# EAGLE design ecg (EAGLE 6.5.0)
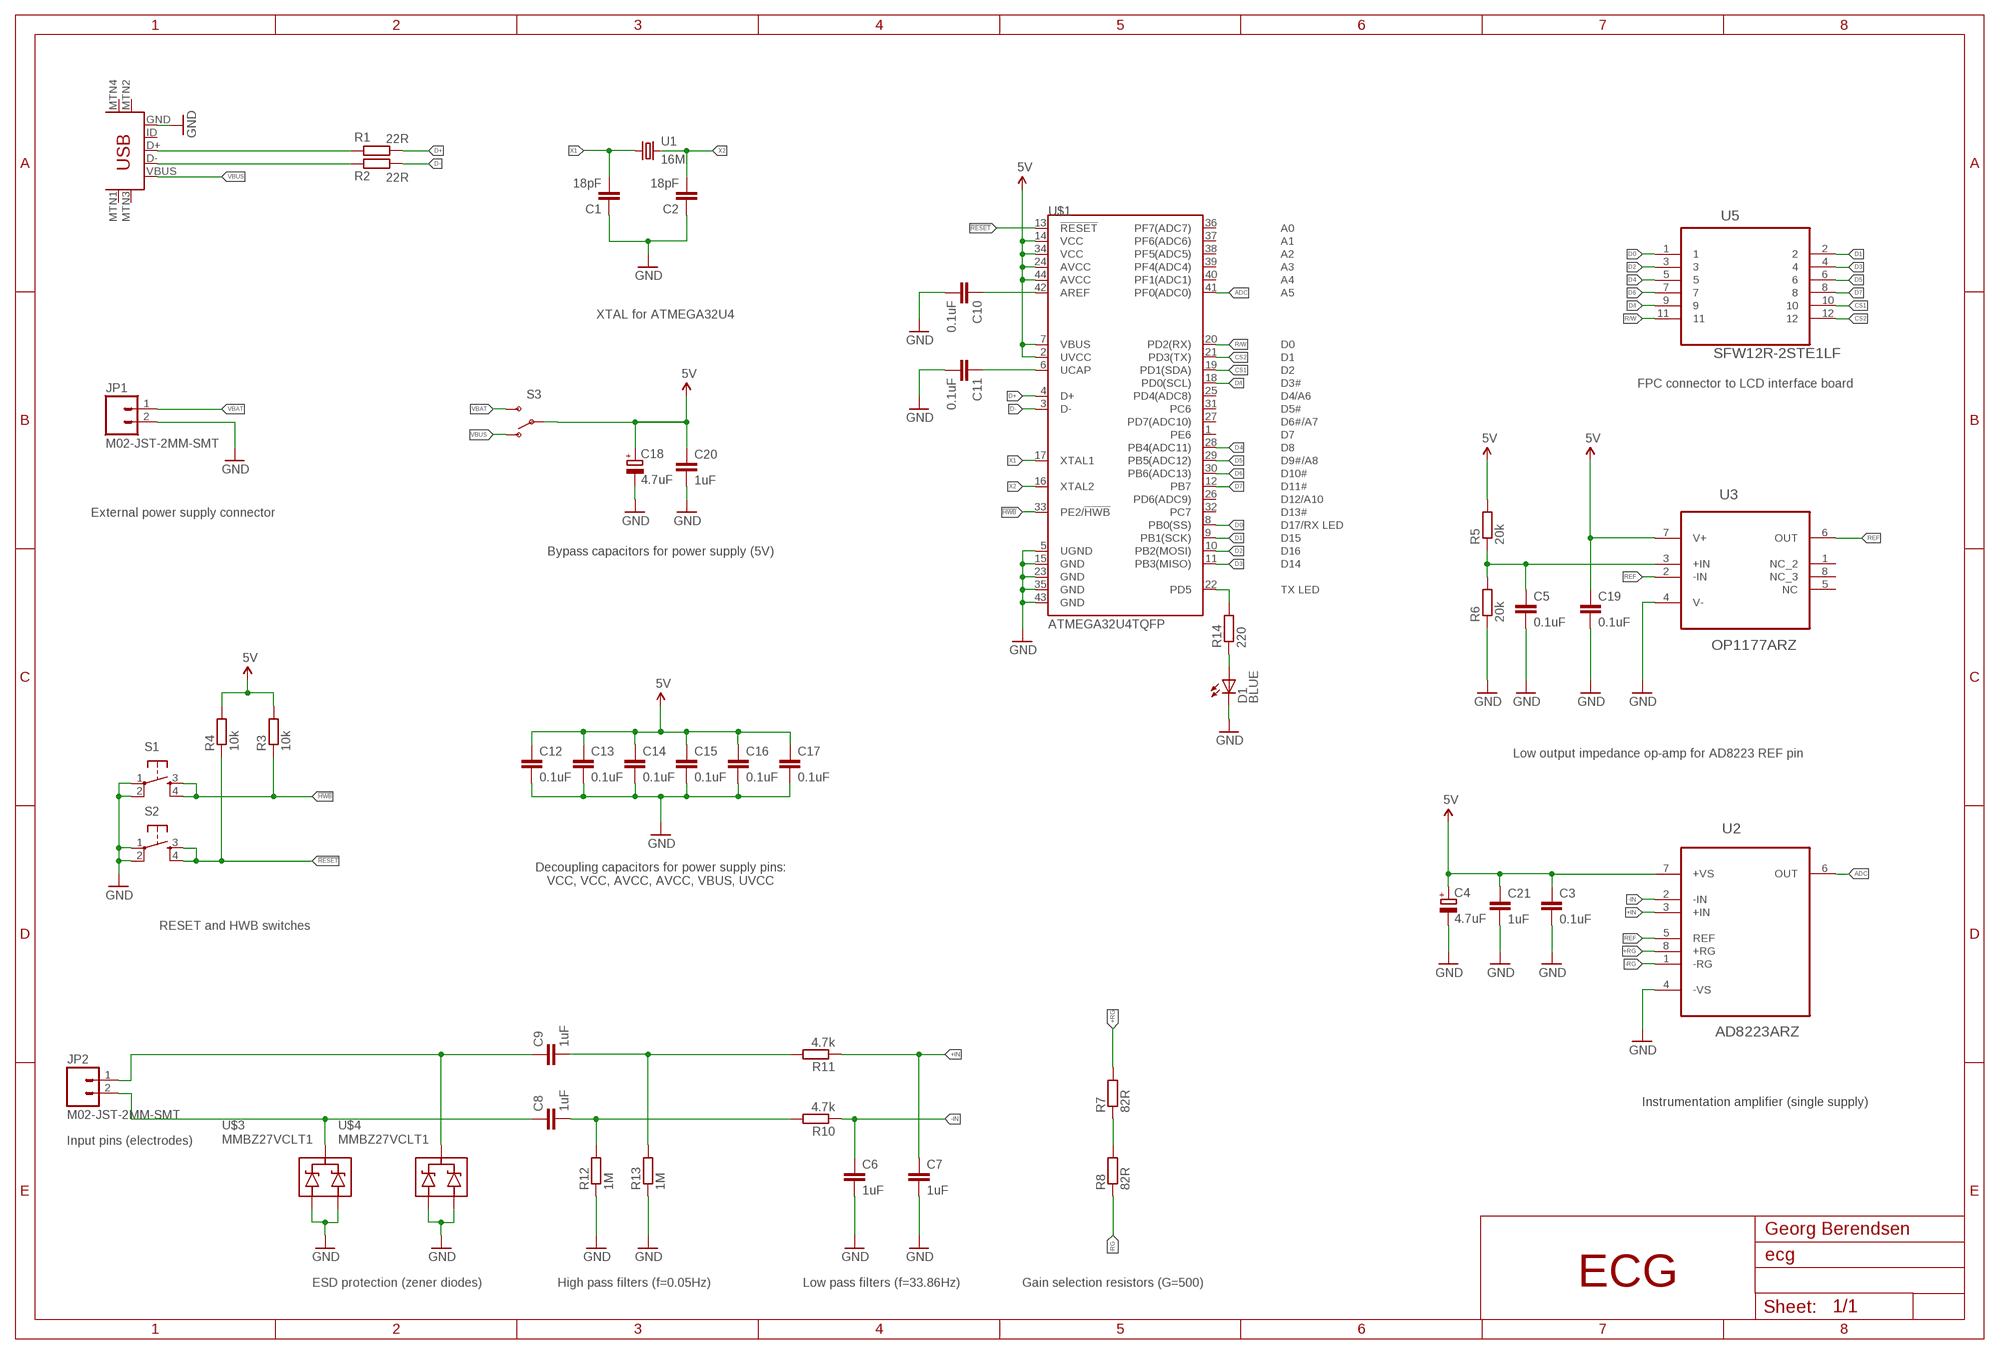
[diagram p0: schematic, sheet 1]

## Parts
C1  18pF  C-EUC0603  [C0603]
C2  18pF  C-EUC0603  [C0603]
C3  0.1uF  C-EUC0603  [C0603]
C4  4.7uF  CPOL-EUA  [PANASONIC_A]
C5  0.1uF  C-EUC0603  [C0603]
C6  1uF  C-EUC0603  [C0603]
C7  1uF  C-EUC0603  [C0603]
C8  1uF  C-EUC0603  [C0603]
C9  1uF  C-EUC0603  [C0603]
C10  0.1uF  C-EUC0603  [C0603]
C11  0.1uF  C-EUC0603  [C0603]
C12  0.1uF  C-EUC0603  [C0603]
C13  0.1uF  C-EUC0603  [C0603]
C14  0.1uF  C-EUC0603  [C0603]
C15  0.1uF  C-EUC0603  [C0603]
C16  0.1uF  C-EUC0603  [C0603]
C17  0.1uF  C-EUC0603  [C0603]
C18  4.7uF  CPOL-EUA  [PANASONIC_A]
C19  0.1uF  C-EUC0603  [C0603]
C20  1uF  C-EUC0603  [C0603]
C21  1uF  C-EUC0603  [C0603]
D1  BLUE  LED-BLUE0603  [LED-0603]
JP1  M02-JST-2MM-SMT  [JST-2-SMD]
JP2  M02-JST-2MM-SMT  [JST-2-SMD]
R1  22R  R-EU_R0603  [R0603]
R2  22R  R-EU_R0603  [R0603]
R3  10k  R-EU_R0603  [R0603]
R4  10k  R-EU_R0603  [R0603]
R5  20k  R-EU_R0603  [R0603]
R6  20k  R-EU_R0603  [R0603]
R7  82R  R-EU_R0603  [R0603]
R8  82R  R-EU_R0603  [R0603]
R10  4.7k  R-EU_R0603  [R0603]
R11  4.7k  R-EU_R0603  [R0603]
R12  1M  R-EU_R0603  [R0603]
R13  1M  R-EU_R0603  [R0603]
R14  220  R-EU_R0603  [R0603]
S1  TAC_SWITCHSMD  [TACTILE_SWITCH_SMD]
S2  TAC_SWITCHSMD  [TACTILE_SWITCH_SMD]
S3  SWITCH-SPDTSMD2  [SWITCH-SPDT-SMD]
U1  16M  CRYSTAL5X3  [CRYSTAL-SMD-5X3]
U2  AD8223ARZ  [SOIC127P600X175-8N]
U3  OP1177ARZ  [SOIC127P600X175-8N]
U5  SFW12R-2STE1LF  [FCI_SFW12R-2STE1LF]
U$1  ATMEGA32U4TQFP  [SPARKFUN-DIGITALIC_TQFP44]
U$2  USB-MINIB-5PIN  [USB-MINIB]
U$3  MMBZ27VCLT1  [SOT23-3]
U$4  MMBZ27VCLT1  [SOT23-3]

## Nets
5V: C3.1 C4.+ C12.1 C13.1 C14.1 C15.1 C16.1 C17.1 C18.+ C19.1 C20.1 C21.1 R3.2 R4.2 R5.2 S3.2(P) U2.7(+VS) U3.7(V+) U$1.2(UVCC) U$1.7(VBUS) U$1.14(VCC) U$1.24(AVCC) U$1.34(VCC) U$1.44(AVCC)
!HWB: R3.1 S1.3 S1.4 U$1.33(PE2/!HWB)
!RESET: R4.1 S2.3 S2.4 U$1.13(!RESET)
+IN: C7.1 R11.1 U2.3(+IN)
+RG: R7.2 U2.8(+RG)
-IN: C6.1 R10.1 U2.2(-IN)
-RG: R8.1 U2.1(-RG)
ADC: U2.6(OUT) U$1.41(PF0(ADC0))
CS1: U5.10 U$1.19(PD1(SDA))
CS2: U5.12 U$1.21(PD3(TX))
D0: U5.1 U$1.8(PB0(SS))
D1: U5.2 U$1.9(PB1(SCK))
D2: U5.3 U$1.10(PB2(MOSI))
D3: U5.4 U$1.11(PB3(MISO))
D4: U5.5 U$1.28(PB4(ADC11))
D5: U5.6 U$1.29(PB5(ADC12))
D6: U5.7 U$1.30(PB6(ADC13))
D7: U5.8 U$1.12(PB7)
D+: R1.1 U$1.4(D+)
D-: R2.1 U$1.3(D-)
D/I: U5.9 U$1.18(PD0(SCL))
GND: C1.1 C2.1 C3.2 C4.- C5.2 C6.2 C7.2 C10.2 C11.2 C12.2 C13.2 C14.2 C15.2 C16.2 C17.2 C18.- C19.2 C20.2 C21.2 D1.C JP1.2 R6.1 R12.1 R13.1 S1.1 S1.2 S2.1 S2.2 U2.4(-VS) U3.4(V-) U$1.5(UGND) U$1.15(GND) U$1.23(GND) U$1.35(GND) U$1.43(GND) U$2.GND U$3.1(A1) U$3.2(A2) U$4.1(A1) U$4.2(A2)
N$1: R1.2 U$2.D+
N$2: R2.2 U$2.D-
N$7: C9.1 JP2.1 U$4.3(C)
N$8: C8.1 JP2.2 U$3.3(C)
N$9: C10.1 U$1.42(AREF)
N$10: C11.1 U$1.6(UCAP)
N$11: D1.A R14.1
N$22: C8.2 R10.2 R12.2
N$23: C9.2 R11.2 R13.2
R/W: U5.11 U$1.20(PD2(RX))
REF: U2.5(REF) U3.2(-IN) U3.6(OUT)
REF_DIV: C5.1 R5.1 R6.2 U3.3(+IN)
RG/2: R7.1 R8.2
TX: R14.2 U$1.22(PD5)
VBAT: JP1.1 S3.3(S)
VBUS: S3.1(O) U$2.VBUS
X1: C1.2 U1.1 U$1.17(XTAL1)
X2: C2.2 U1.3 U$1.16(XTAL2)
Unconnected: U3.1(NC_2) U3.5(NC) U3.8(NC_3) U$1.1(PE6) U$1.25(PD4(ADC8)) U$1.26(PD6(ADC9)) U$1.27(PD7(ADC10)) U$1.31(PC6) U$1.32(PC7) U$1.36(PF7(ADC7)) U$1.37(PF6(ADC6)) U$1.38(PF5(ADC5)) U$1.39(PF4(ADC4)) U$1.40(PF1(ADC1)) U$2.ID U$2.MTN1(MTN2) U$2.MTN2(MTN3) U$2.MTN3(MTN1) U$2.MTN4

## Notes on the sheet
- XTAL for ATMEGA32U4
- FPC connector to LCD interface board
- External power supply connector
- Bypass capacitors for power supply (5V)
- Low output impedance op-amp for AD8223 REF pin
- Decoupling capacitors for power supply pins:
  VCC, VCC, AVCC, AVCC, VBUS, UVCC
- RESET and HWB switches
- Instrumentation amplifier (single supply)
- Input pins (electrodes)
- Georg Berendsen
- ESD protection (zener diodes) | High pass filters (f=0.05Hz) | Low pass filters (f=33.86Hz) | Gain selection resistors (G=500) | ECG

## Library data of the parts
C1-C3 C5-C17 C19-C21 = rcl:C-EU: CAPACITOR, European symbol
C4 C18 = rcl:CPOL-EU: POLARIZED CAPACITOR, European symbol
D1 = SparkFun-LED:LED-BLUE: Blue LEDs for production use Various blue LEDs stocked by SparkFun production 0603 - DIO-08575 Rebel - DIO-09553 1206 - DIO-09911; PROD_ID: DIO-08575
JP1 JP2 = SparkFun-Connectors:M02: Standard 2-pin 0.1" header. Use with - straight break away headers ( PRT-00116) - right angle break away headers (PRT-00553) - swiss pins (PRT-00743) - machine pins (PRT-00117) - female headers (PRT-00115) Molex polarized connector foot print use with: PRT-08233 with associated crimp pins and housings. 2.54_SCREWTERM for use with PRT-10571. 3.5mm Screw Terminal footprints for PRT-08084 5mm Screw Terminal footprints for use with PRT-08433; PROD_ID: CONN-08352
R1-R8 R10-R14 = rcl:R-EU_: RESISTOR, European symbol
S1 S2 = SparkFun-Electromechanical:TAC_SWITCH: Momentary Switch Button commonly used for reset or general input. Spark Fun Electronics SKU : COM-00097 SMT- SWCH-08247; PROD_ID: SWCH-08247
S3 = SparkFun-Electromechanical:SWITCH-SPDT: SPDT Switch Simple slide switch, Spark Fun Electronics SKU : COM-00102 DPDT SMT slide switch, AYZ0202, SWCH-08179
U1 = SparkFun-FreqCtrl:CRYSTAL: Various standard crystals. Proven footprints. Spark Fun Electronics SKU : COM-00534
U2 = AD8223:AD8223ARZ: Single-Supply, Low Cost Instrumentation Amplifier; MPN: AD8223ARZ; OC_FARNELL: 1838863; OC_NEWARK: 34P3215; PACKAGE: SOIC-8; SUPPLIER: Analog Devices
U3 = OP1177ARZ:OP1177ARZ: Precision Low Noise, Low Input Bias Current Operational Amplifiers
U5 = FCI-SFW12R-2STE1LF:SFW12R-2STE1LF: FFC/FPC CONNECTOR, RECEPTACLE 12POS 1ROW; MPN: SFW12R-2STE1LF; OC_FARNELL: 1632142; OC_NEWARK: 43K4079; PACKAGE: CONNECTOR-12POS; SUPPLIER: FCI
U$1 = SparkFun-DigitalIC:ATMEGA32U4: Atmel 44-pin 8-bit Microcontroller with 32KBytes of ISP Flash and USB Controller ----- Please use the QFN-44-NOPAD_1:1 package for the footprint of all boards using a 32U4. Route traces directly away from the pads as much as possible.
U$2 = SparkFun-Connectors:USB-MINIB: Mini-USB "B" connector with 5th pin broken out. Created new symbol breaking out 5th "ID" pin in mini/micro USB connector spec. See: http://en.wikipedia.org/wiki/Mini_usb#Cables. Uses same footprint as 4-pin symbol. Also added pins to connect to mounting / shield pads if required (probably not generally needed as signals aren't shielded once they leave the connector).
U$3 U$4 = SparkFun-DiscreteSemi:MMBZ27VCLT1: 40W Zener-diode transient voltage suppressor (ESD protection)

## Board
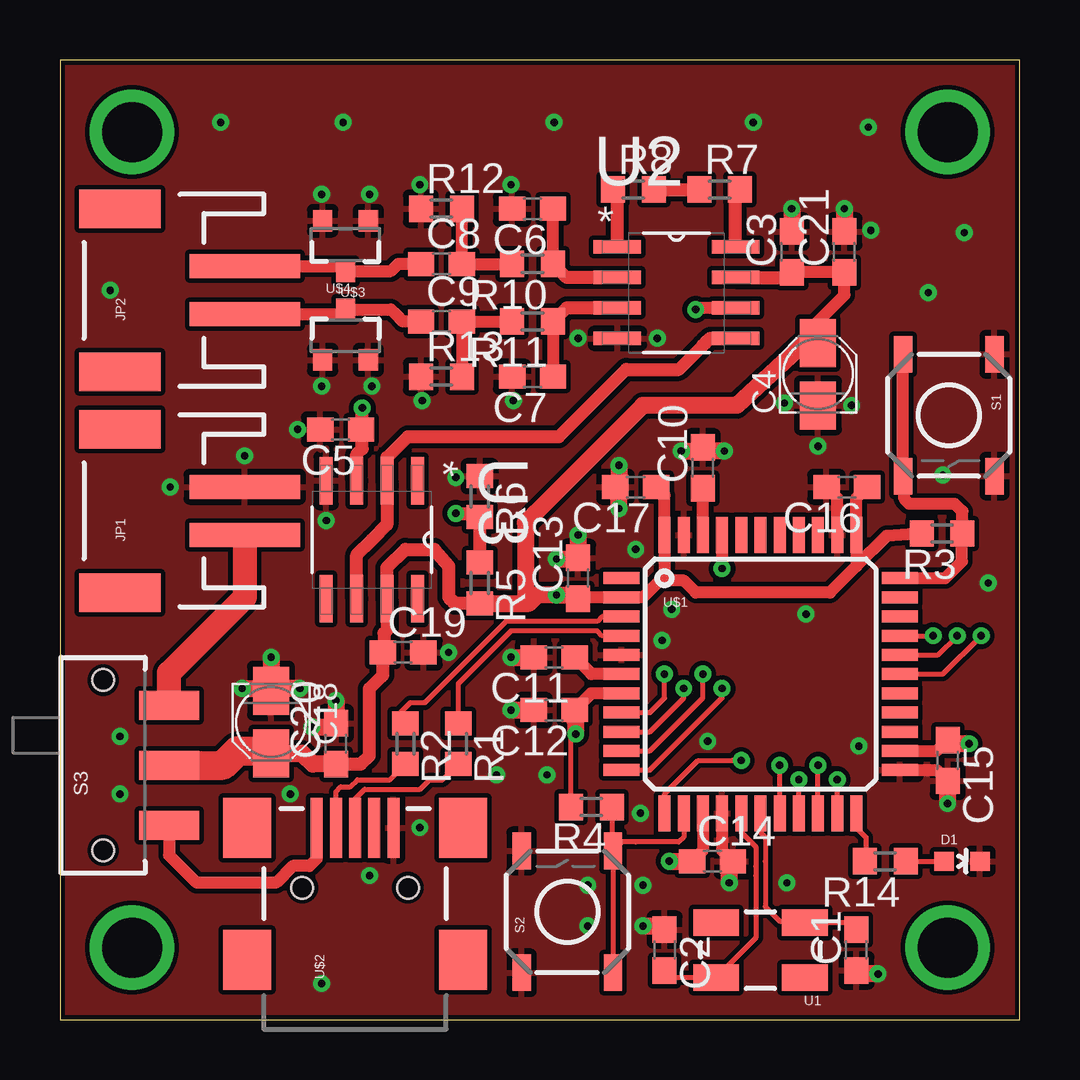
[diagram p1: board, top side]
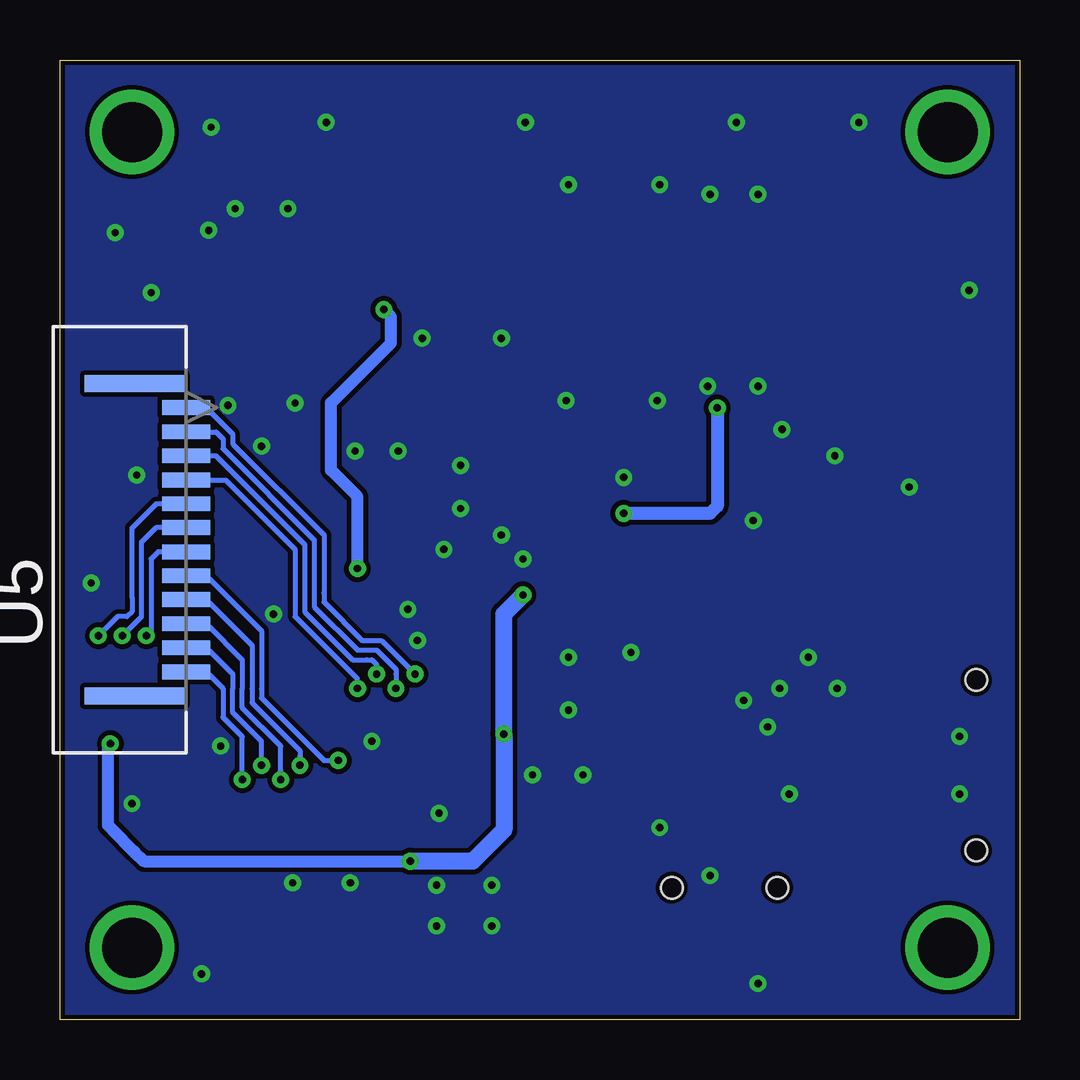
[diagram p2: board, bottom side, seen from below]

Size 40 x 40 mm. Coordinates in mm from the lower left corner, seen from the top.
Outline: 0,0 40,0 40,40 0,40 0,0
Copper layers (1*16): Top 0.035mm / dielectric 1.5mm / Bottom 0.035mm
Design rules "default *": minimum track width 0.2mm, minimum drill 0.3mm, track to track 0.2mm, track to pad 0.2mm, pad to pad 0.2mm, via to via 0.2mm, smd to smd 0mil, copper to edge 0.2mm, drill to drill 8mil, minimum pad ring 10mil, minimum via ring 8mil, stop-mask expansion 4mil, vias tented up to drill 0mil, thermal gap 10mil

### Footprints (pad centres in the part's own frame; a part is rotated, then mirrored left to right if it is on the bottom)
C0603 = smd 1.1 x 1: 1 -0.85,0; 2 0.85,0
PANASONIC_A = smd 2 x 1.5: + 1.3,0; - -1.3,0
LED-0603 = smd 0.8 x 0.8: A 0,-0.75; C 0,0.75
JST-2-SMD = smd 1 x 4.6: 1 -1,-3.7; 2 1,-3.7 | smd 1.6 x 3.4: NC1 -3.4,1.5; NC2 3.4,1.5
R0603 = smd 1 x 1.1: 1 -0.85,0; 2 0.85,0
TACTILE_SWITCH_SMD = smd 1.524 x 0.762: 1 -2.54,1.905; 2 2.54,1.905; 3 -2.54,-1.905; 4 2.54,-1.905
SWITCH-SPDT-SMD = smd 1.2 x 2.5: 1 -2.5,-2.75; 2 0,-2.75; 3 2.5,-2.75 | hole 0.9: -3.55,0; 3.55,0
CRYSTAL-SMD-5X3 = smd 1.9 x 1.1: 1 -1.85,-1.15; 2 1.85,-1.15; 3 1.85,1.15; 4 -1.85,1.15
SOIC127P600X175-8N = smd 1.981 x 0.559: 1 -2.464,1.905; 2 -2.464,0.635; 3 -2.464,-0.635; 4 -2.464,-1.905; 5 2.464,-1.905; 6 2.464,-0.635; 7 2.464,0.635; 8 2.464,1.905
FCI_SFW12R-2STE1LF = smd 0.61 x 2.007: 1 5.512,2.743; 2 4.496,2.743; 3 3.505,2.743; 4 2.489,2.743; 5 1.499,2.743; 6 0.508,2.743; 7 -0.508,2.743; 8 -1.499,2.743; 9 -2.489,2.743; 10 -3.505,2.743; 11 -4.496,2.743; 12 -5.512,2.743 | smd 0.711 x 4.191: 13 -6.502,4.877; 14 6.502,4.877
SPARKFUN-DIGITALIC_TQFP44 = smd 1.5 x 0.5: 1 -5.8,4; 2 -5.8,3.2; 3 -5.8,2.4; 4 -5.8,1.6; 5 -5.8,0.8; 6 -5.8,0; 7 -5.8,-0.8; 8 -5.8,-1.6; 9 -5.8,-2.4; 10 -5.8,-3.2; 11 -5.8,-4; 23 5.8,-4; 24 5.8,-3.2; 25 5.8,-2.4; 26 5.8,-1.6; 27 5.8,-0.8; 28 5.8,0; 29 5.8,0.8; 30 5.8,1.6; 31 5.8,2.4; 32 5.8,3.2; 33 5.8,4 | smd 0.5 x 1.5: 12 -4,-5.8; 13 -3.2,-5.8; 14 -2.4,-5.8; 15 -1.6,-5.8; 16 -0.8,-5.8; 17 0,-5.8; 18 0.8,-5.8; 19 1.6,-5.8; 20 2.4,-5.8; 21 3.2,-5.8; 22 4,-5.8; 34 4,5.8; 35 3.2,5.8; 36 2.4,5.8; 37 1.6,5.8; 38 0.8,5.8; 39 0,5.8; 40 -0.8,5.8; 41 -1.6,5.8; 42 -2.4,5.8; 43 -3.2,5.8; 44 -4,5.8
USB-MINIB = smd 2.5 x 0.5: D+ 2.5,0; D- 2.5,0.8; GND 2.5,-1.6; ID 2.5,-0.8; VBUS 2.5,1.6 | smd 2.5 x 2: MTN1 -3,4.5; MTN2 2.5,4.5; MTN3 -3,-4.5; MTN4 2.5,-4.5 | hole 0.9: 0,2.2; 0,-2.2
SOT23-3 = smd 0.8 x 0.9: 1 -0.95,-1; 2 0.95,-1; 3 0,1.1

### Placement (x,y rotation side)
C1  33.2,2.9 90 top
C2  25.2,2.9 270 top
C3  30.5,32 90 top
C4  31.6,26.9 90 top
C5  11.7,24.6 180 top
C6  19.7,33.8 180 top
C7  19.7,26.8 180 top
C8  15.9,31.5 0 top
C9  15.9,29.1 0 top
C10  26.8,23 90 top
C11  20.6,15.1 180 top
C12  20.6,12.9 180 top
C13  21.6,18.4 90 top
C14  27.2,6.6 0 top
C15  37,10.8 270 top
C16  32.8,22.2 180 top
C17  24,22.2 180 top
C18  8.8,12.4 270 top
C19  14.3,15.3 0 top
C20  11.5,11.5 90 top
C21  32.7,32 90 top
D1  37.6,6.6 270 top
JP1  4,21.2 90 top
JP2  4,30.4 90 top
R1  16.6,11.5 270 top
R2  14.4,11.5 270 top
R3  36.77,20.26 180 top
R4  22.15,8.86 180 top
R5  17.5,18.2 270 top
R6  17.5,21.8 270 top
R7  27.5,34.6 0 top
R8  23.9,34.6 0 top
R10  19.7,31.5 180 top
R11  19.7,29.1 180 top
R12  15.9,33.8 0 top
R13  15.9,26.8 0 top
R14  34.4,6.6 180 top
S1  37.05,25.19 270 top
S2  21.15,4.49 90 top
S3  1.8,10.6 90 top
U1  29.2,2.9 180 top
U2  25.7,30.3 0 top
U3  13,20 270 top
U5  32,20 90 bottom
U$1  29.2,14.4 0 top
U$2  12.3,5.5 90 top
U$3  11.9,32.3 180 top
U$4  11.9,28.5 0 top

### Tracks (layer width: path | path; a pad name or v marks a point on that pad's centre or on a via)
5V  (via drill 0.3)
  Top 0.2: R4.2 21.3,11.7 v21.5,11.9
  Top 0.5: U$1.14 26.8,7.05 C14.1 | U$1.7 22.15,13.6 C12.1 | U$1.24 36.55,11.2 C15.1 | C16.1 33.2,21.75 U$1.34 33.2,18.9 | C17.1 25.2,21.85 U$1.44 25.2,18.5 25,18.3 | C13.1 21.65,17.6 U$1.2 24.3,17.6 25,18.3 | 33.2,18.9 32.1,17.8 26.5,17.8 26,18.3 25,18.3 | R3.2 34.46,20.16 33.2,18.9 | C4.+ 31.6,29.1 32.7,30.2 C21.1 C3.1
  Top 0.55: C20.1 12.55,10.65 12.9,11 12.9,13.2 12.9,13.8 13.4,14.3 13.45,14.35 C19.1 13.5,15.35 13.5,16.1 13.63,16.23 U3.7 13.63,18.84 14.4,19.6 15.6,19.6 16.2,18.9 16.2,17.6 16.4,17.4 16.45,17.35 R5.2 | U2.7 30.29,30.93 C3.1
  Top 0.7: C13.1 21.45,17.7 v20.7,17.7 19.9,17.7 19.8,17.6 19.55,17.35 19.3,17.35 | 26.5,6.45 C14.1 v25.4,6.6 | v37.9,11.5 37.15,11.5 C15.1 | C20.1 10.55,10.65 10.2,11 10.1,11.1 C18.+ | R5.2 19.3,17.35 | C4.+ 31,28.2 28.2,25.6 24.3,25.6 19.8,21.1 19.4,20.7 19.4,17.45 19.3,17.35 | v21.5,11.9 21.5,12.4 21.45,12.45 C12.1 21.5,12.9 21.5,12.6
  Top 1.2: S3.2 6.8,10.6 7.4,11.2 8.7,11.2 C18.+
  Bottom 0.5: v37.9,11.5 38,11.4 38,8.1 37.8,7.9 36.9,7 36.5,6.6 v25.4,6.6
  Bottom 0.7: v20.7,17.7 21.5,16.9 v21.5,11.9 21.5,7.9 22.8,6.6 24.2,6.6 v25.4,6.6
!HWB
  Top 0.5: S1.3 S1.4 35.2,22.59 35.2,21.7 35.4,21.5 37.3,21.5 37.62,21.18 R3.1 37.6,20.34 37.6,19.1 36.9,18.4 U$1.33
!RESET
  Top 0.2: U$1.13 26,7.6 25.8,7.4 24,7.4 23.43,7.4 S2.4 | R4.1 23,7.08 S2.4 | S2.4 S2.3
+IN
  Top 0.5: R11.1 C7.1
  Top 0.55: U2.3 21.11,29.66 R11.1
+RG
  Top 0.55: U2.8 28.16,34.41 R7.2
-IN
  Top 0.5: R10.1 C6.1
  Top 0.55: U2.2 21.11,30.93 R10.1
-RG
  Top 0.55: U2.1 23.24,34.41 R8.1
ADC  (via drill 0.3)
  Top 0.5: U$1.41 v27.6,18.8 | U2.6 26.57,29.66 v26.5,29.6
  Bottom 0.5: v27.6,18.8 27.6,21.8 28.7,22.9 28.7,25.7 26.2,28.2 26.2,29.3 v26.5,29.6
CS1  (via drill 0.3)
  Top 0.2: U$1.19 v30.8,10
  Bottom 0.2: U5.10 33.9,16.5 32.4,15 32.4,13.8 32.4,13 30.8,11.4 30.8,10.4 30.8,10.2 v30.8,10
CS2  (via drill 0.3)
  Top 0.2: U$1.21 v32.4,10
  Bottom 0.2: U5.12 33.89,14.49 33.2,13.8 33.2,12.6 32.4,11.8 v32.4,10
D0  (via drill 0.3)
  Top 0.2: U$1.8 24.6,12.8 25.2,13.4 v25.2,14.4
  Bottom 0.2: U5.1 33.91,25.51 32.8,24.4 32.8,24 29,20.2 29,17.8 29,17.4 27.4,15.8 26.6,15.8 25.6,14.8 v25.2,14.4
D1  (via drill 0.3)
  Top 0.2: U$1.9 24.6,12 26,13.4 v26,13.8
  Bottom 0.2: U5.2 33.5,24.5 33.2,24.2 33.2,23.8 29.4,20 29.4,17.8 29.4,17.2 27.6,15.4 26.8,15.4 26,14.6 26,14.4 v26,13.8
D2  (via drill 0.3)
  Top 0.2: U$1.10 24.6,11.2 26.8,13.4 v26.8,14.4
  Bottom 0.2: U5.3 33.51,23.5 29.8,19.8 29.8,17.2 29.8,17 27.8,15 27.2,15 27,15 26.8,14.8 v26.8,14.4
D3  (via drill 0.3)
  Top 0.2: U$1.11 24.6,10.4 27.6,13.4 v27.6,13.8
  Bottom 0.2: U5.4 33.09,22.49 30.2,19.6 30.2,16.8 27.6,14.2 v27.6,13.8
D4  (via drill 0.3)
  Top 0.2: U$1.28 36.8,14.4 v38.4,16
  Bottom 0.2: U5.5 36,21.5 37,20.5 37,20.4 37,17.6 37,17 37.2,16.8 37.6,16.8 v38.4,16
D5  (via drill 0.3)
  Top 0.2: U$1.29 36.6,15.2 v37.4,16
  Bottom 0.2: U5.6 36,20.51 36.6,19.91 36.6,16.8 v37.4,16
D6  (via drill 0.3)
  Top 0.2: U$1.30 v36.4,16
  Bottom 0.2: U5.7 35.91,19.49 36,19.4 36.2,19.2 36.2,16.2 v36.4,16
D7  (via drill 0.3)
  Top 0.2: 28,10.8 v28.4,10.8 26.6,10.8 25.6,9.8 25.2,9.4 U$1.12
  Bottom 0.2: U5.8 33.9,18.5 31.6,16.2 31.6,13.8 31.6,13.4 29,10.8 v28.4,10.8
D+
  Top 0.2: U$1.4 22.6,16 22.4,16.2 19.2,16.2 18.95,16.2 18.8,16.2 17.8,15.2 16.6,14 R1.1
D-
  Top 0.2: U$1.3 22.6,16.8 22.4,16.6 19.2,16.6 18.95,16.6 18.6,16.6 17.4,15.4 15.2,13.2 14.6,13.2 14.2,12.8 14.2,12.45 R2.1
D/I  (via drill 0.3)
  Top 0.2: U$1.18 v30,10.6
  Bottom 0.2: U5.9 33.91,17.51 32,15.6 32,13.8 32,13.2 30,11.2 v30,10.6 30,11
GND  (via drill 0.3)
  Top 0.5: U$1.15 27.6,7.05 C14.2 | U$1.23 36.55,10.4 C15.2 | U$1.35 32.4,21.75 C16.2
  Top 0.7: v18.8,15.1 C11.2 | v18.8,12.9 C12.2 19.6,13.05 | 21.45,19.4 C13.2 | 23,22.05 C17.2 | 26.65,24 C10.2 | v24.3,3.9 25.05,3.9 C2.1 | v34.1,1.9 33.35,1.9 C1.1 | 28.2,6.45 C14.2 27.9,6.45 v27.9,5.7 | 37.05,10 C15.2 v37,9 | v7.6,13.8 8.7,13.8 C18.- | v10,13.8 8.9,13.8 C18.- | 11.35,12.5 C20.2 | v21.6,20.2 C13.2 | 23,22.35 C17.2 | 21.75,19.4 C13.2 | 11.65,12.5 C20.2 | v10.5,12.2 11.35,12.2 C20.2 | v20.7,19.2 21.55,19.2 C13.2 | v23.3,21.3 23.3,22.05 C17.2 | v23.3,23.1 23.3,22.35 C17.2 | v25.9,23.7 26.65,23.7 C10.2 | v27.7,23.7 26.95,23.7 C10.2 | 30.35,32.7 C3.2 v30.5,33.8 | 32.85,32.7 C21.2 v32.7,33.8 | 11,27.45 U$4.1 | 12.8,27.45 U$4.2 | 12.8,33.35 U$3.1 | 11,33.35 U$3.2 | v8.8,15.1 C18.- | v11.5,13.3 C20.2 | 31.8,22.35 C16.2 31.8,22.35
  other vias: 10.9,26.4 13,26.4 10.9,34.4 12.9,34.4 15,34.8 18.8,34.8 15.1,25.8 18.9,25.8 21.6,28.4 24.9,28.4 9.9,24.6 11.1,20.8 16.2,15.3 7.7,23.5 31.6,23.9 33,25.6 30.2,25.7 33.8,32.9 30.3,5.7 36.8,22.7 38.7,18.2 36.2,30.3 24.3,5.6 15,8 12.9,6 22,3.9 18.2,10.2 9.6,9.4 2.5,9.4 2.5,11.8 4.6,22.2 2.1,30.4 16.5,22.6 31.1,16.9 27,11.6 24.2,8.6 22,5.6 20.3,10.2 25.5,17.1 25.1,15.8 24,19.6 11.8,37.4 28.9,37.4 20.6,37.4 6.7,37.4 33.7,37.2 37.7,32.8 10.9,1.5 33.3,11.4
  pour Top: 0,40 40,40 40,0 0,0
  pour Bottom: 0,40 40,40 40,0 0,0
N$1
  Top 0.2: U$2.D+ 12.3,9.2 12.7,9.6 15,9.6 15.4,10 15.95,10 R1.2
N$2
  Top 0.2: U$2.D- 11.5,9.5 11.7,9.7 12.1,9.7 12.4,10 13.75,10 R2.2
N$3  (via drill 2.5)
  other vias: 3,37
N$4  (via drill 2.5)
  other vias: 37,37
N$5  (via drill 2.5)
  other vias: 3,3
N$6  (via drill 2.5)
  other vias: 37,3
N$7
  Top 0.5: JP2.1 11.7,29.4 U$4.3 13.8,29.6 14,29.4 14.3,29.1 C9.1
N$8
  Top 0.5: JP2.2 11.7,31.4 U$3.3 13.8,31.2 14,31.4 14.1,31.5 C8.1
N$9
  Top 0.5: U$1.42 C10.1
N$10
  Top 0.5: U$1.6 22.15,14.4 C11.1
N$11
  Top 0.2: R14.1 D1.A
N$22
  Top 0.5: R10.2 C8.2 R12.2
N$23
  Top 0.5: R11.2 C9.2 R13.2
R/W  (via drill 0.3)
  Top 0.2: U$1.20 v31.6,10.6
  Bottom 0.2: U5.11 33.9,15.5 32.8,14.4 32.8,13.8 32.8,12.8 31.6,11.6 31.6,10.8 v31.6,10.6
REF
  Top 0.55: U3.6 12.37,19.36 13,20 13.63,20.64 U3.2 13.63,23.43 14.5,24.3 20.8,24.3 23.6,27.1 25.8,27.1 26.8,28.1 26.89,28.2 27.09,28.39 U2.5
REF_DIV  (via drill 0.3)
  Top 0.55: R5.1 R6.2 17.35,21.1 v16.5,21.1 | v12.6,25.5 12.6,24.8 12.55,24.75 C5.1 12.6,24.55 12.6,23.8 12.37,23.57 U3.3
  Bottom 0.55: v12.6,25.5 12.6,21.4 12.9,21.1 v16.5,21.1
RG/2
  Top 0.55: R8.2 R7.1
TX
  Top 0.2: U$1.22 33.2,8 33.6,7.6 33.6,6.65 R14.2
VBAT
  Top 1: JP1.1 7.7,17.6 4.7,14.6 4.55,14.45 S3.3
VBUS
  Top 0.5: U$2.VBUS 10.7,6.7 10.4,6.4 9.7,6.4 9,5.7 6.7,5.7 5.7,5.7 4.9,6.5 4.55,6.85 S3.1
X1
  Top 0.2: U$1.17 29.2,7.8 29.4,7.6 29.4,6.6 29.4,4.7 30,4.1 31,4.1 U1.1 32.9,4.05 C1.2
X2
  Top 0.2: U$1.16 28.4,7.8 29,7.2 29,6.4 29,6 29,3.4 U1.3 25.5,1.75 C2.2